# Altium schematic sheet HI_Amplifer_schematic.SchDoc: HI Amplifier
size Letter; DrawnBy: Kevin Bandura; Engineer: Kevin Bandura
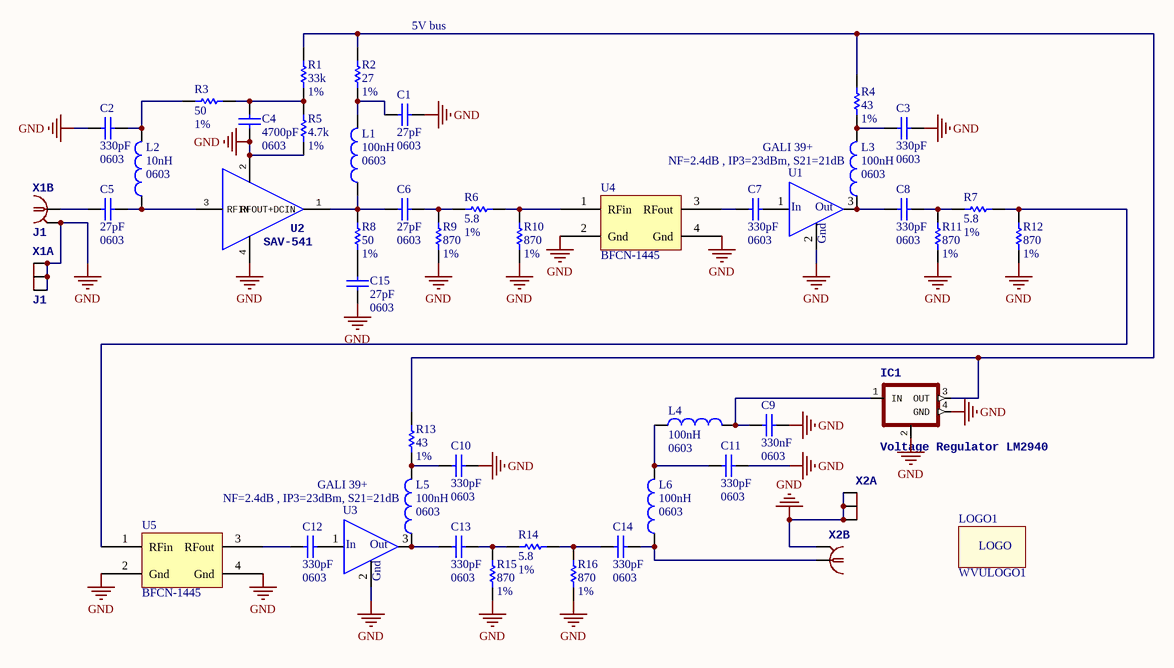
[diagram p0: HI_Amplifer_schematic.SchDoc]

## Parts
C1  27pF  [0603]
C2  330pF  [0603]
C3  330pF  [0603]
C4  4700pF  [0603]
C5  27pF  [0603]
C6  27pF  [0603]
C7  330pF  [0603]
C8  330pF  [0603]
C9  330nF  [0603]
C10  330pF  [0603]
C11  330pF  [0603]
C12  330pF  [0603]
C13  330pF  [0603]
C14  330pF  [0603]
C15  27pF  [0603]
IC1  Voltage Regulator LM2940  [SOT223]
L1  100nH  Param: 0603  [0805]
L2  10nH  Param: 0603  [0805]
L3  100nH  Param: 0603  [0805]
L4  100nH  Param: 0603  [0805]
L5  100nH  Param: 0603  [0805]
L6  100nH  Param: 0603  [0805]
LOGO1  WVULOGO1  [WVULOGO1]
R1  33k  Param: 1%  [0603]
R2  27  Param: 1%  [0603]
R3  50  Param: 1%  [0603]
R4  43  Param: 1%  [0603]
R5  4.7k  Param: 1%  [0603]
R6  5.8  Param: 1%  [0603]
R7  5.8  Param: 1%  [0603]
R8  50  Param: 1%  [0603]
R9  870  Param: 1%  [0603]
R10  870  Param: 1%  [0603]
R11  870  Param: 1%  [0603]
R12  870  Param: 1%  [0603]
R13  43  Param: 1%  [0603]
R14  5.8  Param: 1%  [0603]
R15  870  Param: 1%  [0603]
R16  870  Param: 1%  [0603]
U1  GALI 39+  PartConstraints: NF=2.4dB , IP3=23dBm, S21=21dB  [SBA5089]
U2  SAV-541  [SOT343]
U3  GALI 39+  PartConstraints: NF=2.4dB , IP3=23dBm, S21=21dB  [SBA5089]
U4  BFCN-1445  [FV1206]
U5  BFCN-1445  [FV1206]
X1  J1  [LTI-SASF54GT]  (parts A,B of 2)
X2  SMA vertical PCB thrue hole jack   Source: Lighthorse Technologies, inc. SASF54GT.pdf  [LTI-SASF54GT]  (value not drawn)  (parts A,B of 2)

## Nets
GND: C1.2 C2.1 C3.2 C4.1 C9.2 C10.2 C11.2 C15.1 IC1.2(GND) IC1.4(GND) R5.1 R9.1 R10.1 R11.1 R12.1 R15.1 R16.1 U1.2(Gnd) U2.2(GND@2) U2.4(GND@4) U3.2(Gnd) U4.2(Gnd) U4.4(Gnd) U5.2(Gnd) U5.4(Gnd) X1.2(GND) X1.3(GND@1) X1.4(GND@2) X1.5(GND@3) X2.2(GND) X2.3(GND@1) X2.4(GND@2) X2.5(GND@3)
NetC1_1: C1.1 L1.2 R2.1
NetC2_2: C2.2 L2.2 R3.1
NetC3_1: C3.1 L3.2 R4.1
NetC4_2: C4.2 R1.1 R3.2 R5.2
NetC5_1: C5.1 X1.1
NetC5_2: C5.2 L2.1 U2.3(RFIN)
NetC6_1: C6.1 L1.1 R8.2 U2.1(RFOUT+DCIN)
NetC6_2: C6.2 R6.1 R9.2
NetC7_1: C7.1 U4.3(RFout)
NetC7_2: C7.2 U1.1(In)
NetC8_1: C8.1 L3.1 U1.3(Out)
NetC8_2: C8.2 R7.1 R11.2
NetC9_1: C9.1 IC1.1(IN) L4.2
NetC10_1: C10.1 L5.2 R13.1
NetC11_1: C11.1 L4.1 L6.2
NetC12_1: C12.1 U5.3(RFout)
NetC12_2: C12.2 U3.1(In)
NetC13_1: C13.1 L5.1 U3.3(Out)
NetC13_2: C13.2 R14.1 R15.2
NetC14_1: C14.1 R14.2 R16.2
NetC14_2: C14.2 L6.1 X2.1
NetC15_2: C15.2 R8.1
NetIC1_3: IC1.3(OUT) R1.2 R2.2 R4.2 R13.2
NetR6_2: R6.2 R10.2 U4.1(RFin)
NetR7_2: R7.2 R12.2 U5.1(RFin)

## Notes on the sheet
- 5V bus
- (in symbol WVULOGO1) LOGO

## Library data of the parts
C1-C15 = Cap0603: Capacitor, Ceramic, 0603; TechInf: *; Param1: *
IC1 = V_REG_LM2940SOT223_1
L1-L6 = Inductor0: Inductor; Manufacturer: Taiyo Yuden; Manufacturers P/N: CBL2012T470M
R1-R16 = Res0603: Resistor; Param1: 100ppm/C; Value: DNL; TechInfo: *
U1 U3 = GALI 39+: RFMD Amplifier DC-5Ghz; ManufPartNumber: GALI 39+
U4 U5 = BFCN-1445: CanPurchaseFrom: Minicircuits; Part constraints: BFCN-1445; Manufacturers P/N: BFCN-1445; Manufacturer: Minicircuits
X1 X2 = LTI-SASF54GT: OC_FARNELL: unknown; OC_NEWARK: unknown